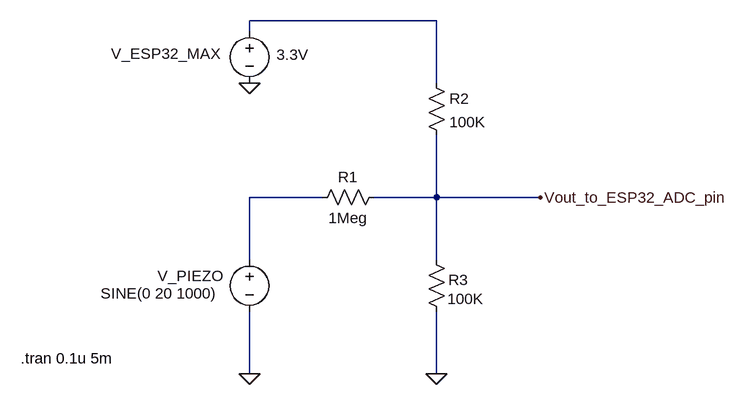
[diagram p0: schematic piezo_3Resistor_voltage_divider_DC_offset_circuit.asc]
piezo_3Resistor_voltage_divider_DC_offset_circuit.asc, the LTspice schematic file:
Version 4
SHEET 1 936 680
WIRE 464 -176 176 -176
WIRE 176 -160 176 -176
WIRE 464 -80 464 -176
WIRE 288 96 176 96
WIRE 464 96 464 0
WIRE 464 96 368 96
WIRE 624 96 464 96
WIRE 176 192 176 96
WIRE 464 192 464 96
WIRE 176 368 176 272
WIRE 464 368 464 272
FLAG 176 368 0
FLAG 464 368 0
FLAG 176 -80 0
FLAG 624 96 Vout_to_ESP32_ADC_pin
SYMBOL voltage 176 176 R0
WINDOW 3 -229 68 Left 2
WINDOW 123 24 124 Left 2
WINDOW 39 0 0 Left 0
WINDOW 0 -141 41 Left 2
SYMATTR Value SINE(0 20 1000)
SYMATTR InstName V_PIEZO
SYMBOL res 384 80 R90
WINDOW 0 0 56 VBottom 2
WINDOW 3 32 56 VTop 2
SYMATTR InstName R1
SYMATTR Value 1Meg
SYMBOL res 480 288 R180
WINDOW 0 -33 65 Left 2
WINDOW 3 -57 36 Left 2
SYMATTR InstName R3
SYMATTR Value 100K
SYMBOL res 448 -96 R0
SYMATTR InstName R2
SYMATTR Value 100K
SYMBOL voltage 176 -176 R0
WINDOW 0 -213 51 Left 2
WINDOW 3 42 52 Left 2
SYMATTR InstName V_ESP32_MAX
SYMATTR Value 3.3V
TEXT -176 344 Left 2 !.tran 0.1u 5m

The netlist it stands for:
* piezo_3Resistor_voltage_divider_DC_offset_circuit.asc
V_PIEZO N002 0 SINE(0 20 1000)
R1 Vout_to_ESP32_ADC_pin N002 1Meg
R3 0 Vout_to_ESP32_ADC_pin 100K
R2 N001 Vout_to_ESP32_ADC_pin 100K
V_ESP32_MAX N001 0 3.3V
.tran 0.1u 5m
.backanno
.end